# EAGLE design GERMO (EAGLE 9.4.2)
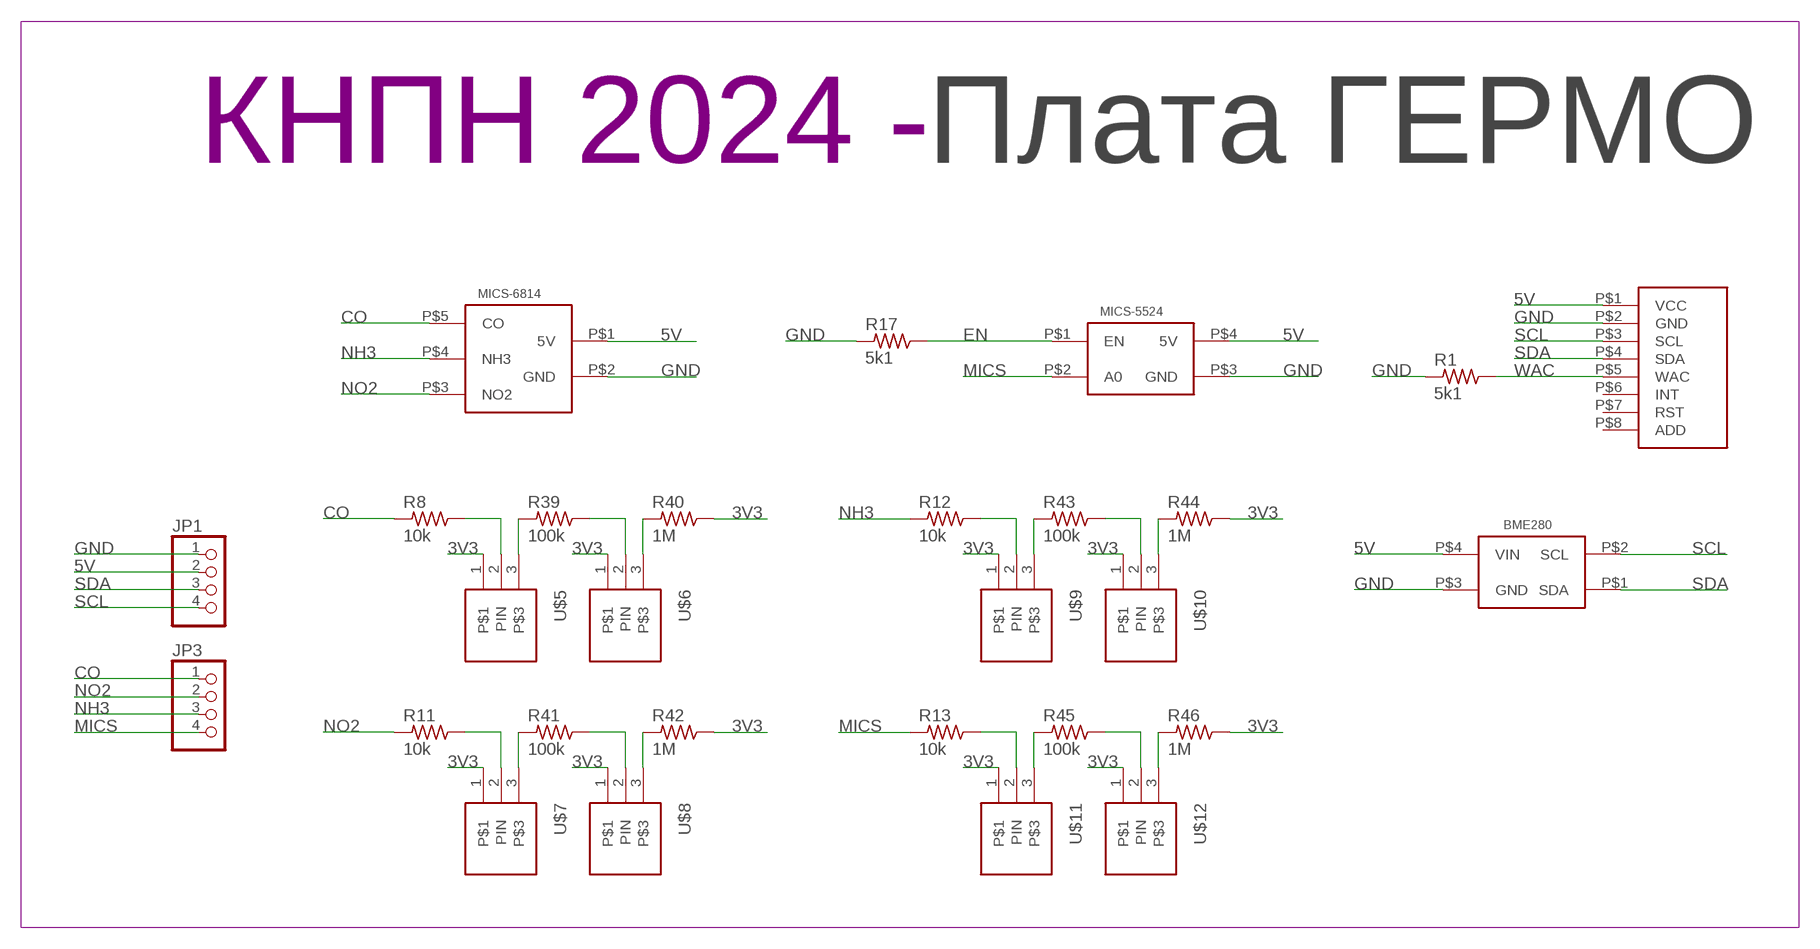
[diagram p0: schematic, sheet 1]

## Parts
BME280  BME280BME280-PINS-ONLY  [BME280-PINS-ONLY]
JP1  PINHD-1X4  [1X04]
JP3  PINHD-1X4  [1X04]
MICS-5524  MICS_5524  [MICS-5524]
MICS-6814  MICS-6814  [MICS-6814]
R1  5k1  R-US_R0603  [R0603]
R8  10k  R-US_R0603  [R0603]
R11  10k  R-US_R0603  [R0603]
R12  10k  R-US_R0603  [R0603]
R13  10k  R-US_R0603  [R0603]
R17  5k1  R-US_R0603  [R0603]
R39  100k  R-US_R0603  [R0603]
R40  1M  R-US_R0603  [R0603]
R41  100k  R-US_R0603  [R0603]
R42  1M  R-US_R0603  [R0603]
R43  100k  R-US_R0603  [R0603]
R44  1M  R-US_R0603  [R0603]
R45  100k  R-US_R0603  [R0603]
R46  1M  R-US_R0603  [R0603]
U$2  Плата ГЕРМО  LOGOPCB-""  [LOGO]
U$4  CCS811  [CSS811]
U$5  CONNECT_3  [CONNECT_3]
U$6  CONNECT_3  [CONNECT_3]
U$7  CONNECT_3  [CONNECT_3]
U$8  CONNECT_3  [CONNECT_3]
U$9  CONNECT_3  [CONNECT_3]
U$10  CONNECT_3  [CONNECT_3]
U$11  CONNECT_3  [CONNECT_3]
U$12  CONNECT_3  [CONNECT_3]

## Nets
3V3: R40.1 R42.1 R44.1 R46.1 U$5.1 U$6.1 U$7.1 U$8.1 U$9.1 U$10.1 U$11.1 U$12.1
5V: BME280.P$4(VIN) JP1.2 MICS-5524.P$4(5V) MICS-6814.P$1(5V) U$4.P$1(VCC)
CO: JP3.1 MICS-6814.P$5(CO) R8.2
EN: MICS-5524.P$1(EN) R17.1
GND: BME280.P$3(GND) JP1.1 MICS-5524.P$3(GND) MICS-6814.P$2(GND) R1.2 R17.2 U$4.P$2(GND)
MICS: JP3.4 MICS-5524.P$2(A0) R13.2
N$1: R39.2 U$5.3
N$2: R8.1 U$5.2(PIN)
N$3: R40.2 U$6.3
N$4: R39.1 U$6.2(PIN)
N$5: R41.2 U$7.3
N$6: R11.1 U$7.2(PIN)
N$7: R42.2 U$8.3
N$8: R41.1 U$8.2(PIN)
N$9: R43.2 U$9.3
N$10: R12.1 U$9.2(PIN)
N$11: R44.2 U$10.3
N$12: R43.1 U$10.2(PIN)
N$13: R45.2 U$11.3
N$14: R13.1 U$11.2(PIN)
N$15: R46.2 U$12.3
N$16: R45.1 U$12.2(PIN)
NH3: JP3.3 MICS-6814.P$4(NH3) R12.2
NO2: JP3.2 MICS-6814.P$3(NO2) R11.2
SCL: BME280.P$2(SCL) JP1.4 U$4.P$3(SCL)
SDA: BME280.P$1(SDA) JP1.3 U$4.P$4(SDA)
WAC: R1.1 U$4.P$5(WAC)
Unconnected: U$4.P$6(INT) U$4.P$7(RST) U$4.P$8(ADD)

## Library data of the parts
BME280 = UNKNOWN-2024:BME280
JP1 JP3 = pinhead:PINHD-1X4: PIN HEADER
MICS-5524 = UNKNOWN-2024:MICS_5524
MICS-6814 = CanCubeSat:MICS-6814
R1 R8 R11-R13 R17 R39-R46 = rcl:R-US_: RESISTOR, American symbol; SPICEPREFIX: R
U$2 = UNKNOWN-2024:LOGO
U$4 = UNKNOWN-2024:CCS811
U$5-U$12 = UNKNOWN-2024:CONNECT_3

## Board
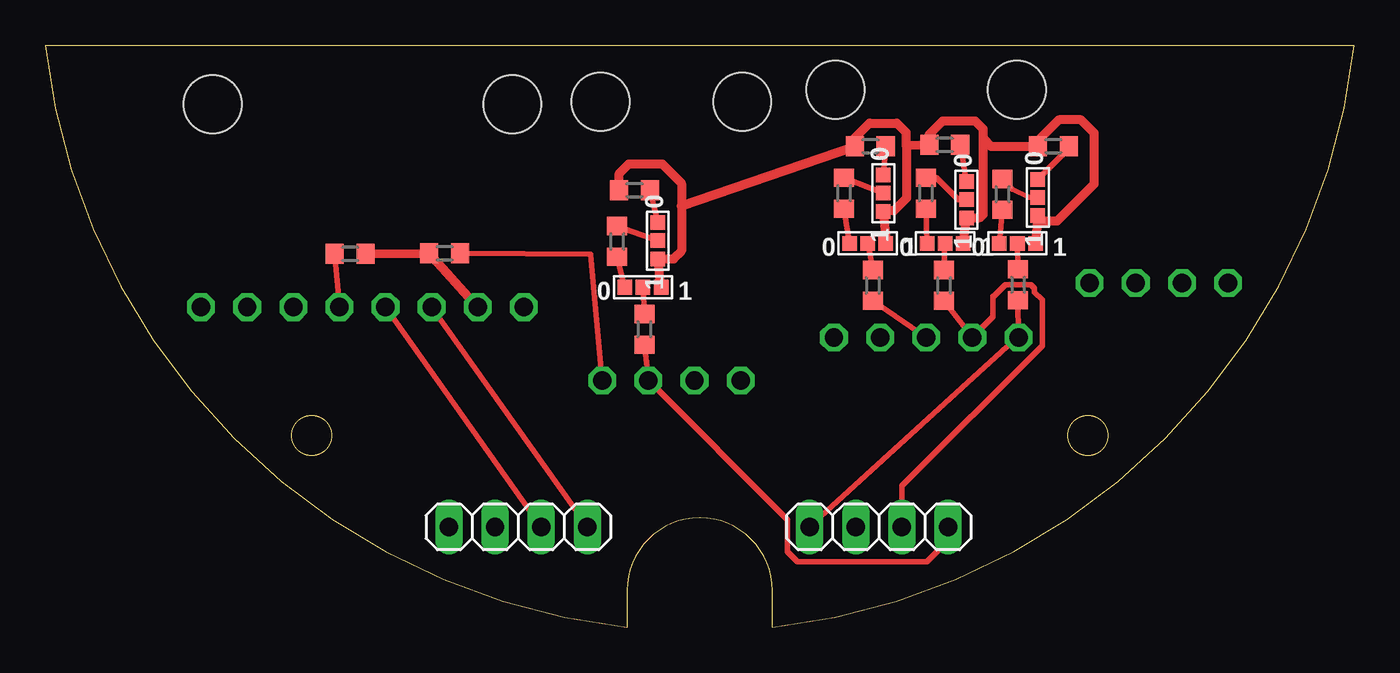
[diagram p1: board, top side]
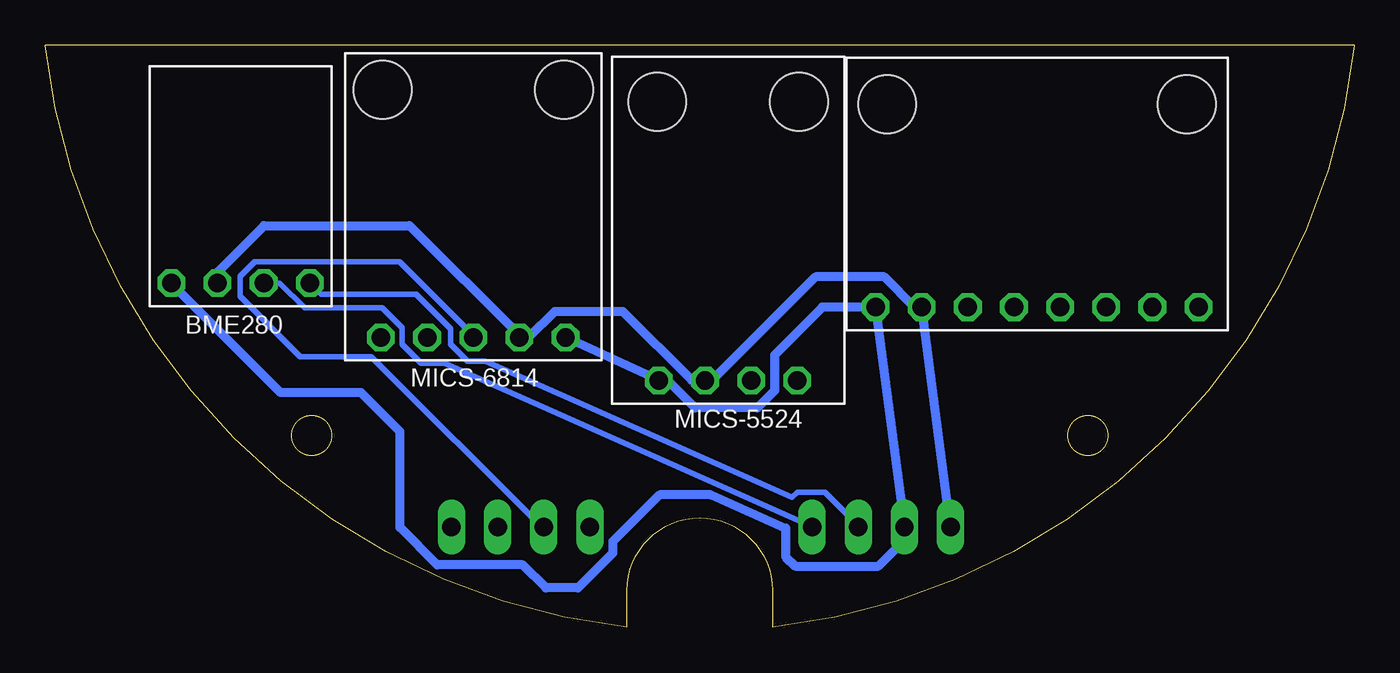
[diagram p2: board, bottom side, seen from below]

Size 72.06 x 32.03 mm. Coordinates in mm from the lower left corner, seen from the top.
Outline: 32.03,2.03 32.03,0 arc-77 0,32.03 72.06,32.03 arc-77 40.03,0 40.03,2.03 arc180 32.03,2.03
Outline: circle at 14.66,10.56 radius 1.1
Outline: circle at 57.4,10.56 radius 1.1
Copper layers (1*16): Top 0.035mm / dielectric 1.5mm / Bottom 0.035mm
Design rules "default *": minimum track width 0.3mm, minimum drill 0.35mm, track to track 0.2mm, track to pad 0.2mm, pad to pad 0.2mm, via to via 0.2mm, smd to smd 0.2mm, copper to edge 0.35mm, drill to drill 0.2mm, minimum pad ring 10mil, minimum via ring 8mil, stop-mask expansion 4mil, vias tented up to drill 0mil, thermal gap 10mil

### Footprints (pad centres in the part's own frame; a part is rotated, then mirrored left to right if it is on the bottom)
BME280-PINS-ONLY = drill 1.016 octagon: P$1 -3.81,5.33; P$2 -1.27,5.33; P$3 1.27,5.33; P$4 3.81,5.33
1X04 = drill 1.016 long: 1 -3.81,0; 2 -1.27,0; 3 1.27,0; 4 3.81,0
MICS-5524 = drill 1.016 octagon: P$1 -3.81,8.28; P$2 -1.27,8.28; P$3 1.27,8.28; P$4 3.81,8.28 | hole 3.2: -3.9,-7.05; 3.9,-7.05
MICS-6814 = drill 1.016 octagon: P$1 -5.08,7.18; P$2 -2.54,7.18; P$3 0,7.18; P$4 2.54,7.18; P$5 5.08,7.18 | hole 3.2: -5,-6.45; 5,-6.45
R0603 = smd 1 x 1.1: 1 -0.85,0; 2 0.85,0
CSS811 = drill 1.016 octagon: P$1 6.23,-8.89; P$2 6.23,-6.35; P$3 6.23,-3.81; P$4 6.23,-1.27; P$5 6.23,1.27; P$6 6.23,3.81; P$7 6.23,6.35; P$8 6.23,8.89 | hole 3.2: -4.95,-8.25; -4.95,8.25
CONNECT_3 = smd 0.8 x 0.8: 1 1,0; 2 0,0; 3 -1,0

### Placement (x,y rotation side)
BME280  61.31,24.28 180 bottom
JP1  26.03,5.53 0 top
JP3  45.89,5.53 0 top
MICS-5524  34.47,21.87 180 bottom
MICS-6814  48.5,23.14 180 bottom
R1  16.78,20.56 0 top
R8  53.56,18.86 270 top
R11  45.56,18.82 270 top
R12  49.48,18.82 270 top
R13  32.98,16.4 270 top
R17  21.98,20.58 180 top
R39  52.7,23.83 270 top
R40  55.5,26.48 0 top
R41  43.98,23.89 270 top
R42  45.42,26.48 0 top
R43  48.48,23.89 270 top
R44  49.52,26.56 0 top
R45  31.48,21.24 270 top
R46  32.44,24.06 0 top
U$2  28.73,41.06 0 top  (outside the outline)
U$4  17.46,23.85 270 bottom
U$5  53.52,21.14 0 top
U$6  54.64,23.66 270 top
U$7  45.28,21.14 0 top
U$8  46.14,23.9 270 top
U$9  49.54,21.14 0 top
U$10  50.72,23.54 270 top
U$11  32.9,18.72 0 top
U$12  33.72,21.28 270 top

### Tracks (layer width: path | path; a pad name or v marks a point on that pad's centre or on a via)
3V3
  Top 0.5: U$11.1 U$12.1 34.59,20.28 35.02,20.71 35.02,23.2 | 35.02,23.2 35.02,24.45 33.96,25.51 32.12,25.51 31.59,24.98 R46.1 | 35.02,23.2 R42.1 44.57,26.94 45.38,27.75 46.88,27.75 47.39,27.24 47.39,26.53 47.42,26.53 | 47.42,26.53 47.42,23.63 46.73,22.94 46.18,22.94 U$8.1 U$7.1 | 47.42,26.53 47.52,26.54 R44.1 48.67,27.13 49.42,27.88 51.18,27.88 51.64,27.42 51.64,26.91 | 51.64,26.91 52.07,26.48 R40.1 54.65,26.79 55.79,27.93 57.02,27.93 57.75,27.2 57.75,24.4 55.71,22.36 54.94,22.36 U$6.1 U$5.1 | U$9.1 U$10.1 50.73,22.55 51.46,22.55 51.64,22.73 51.64,26.91
5V
  Bottom 0.5: MICS-6814.P$1 MICS-5524.P$4 37.81,13.59 36.3,12.08 32.86,12.08 31.91,13.03 31.91,14.98 29.28,17.62 U$4.P$1 JP1.2 24.76,4.8 26.2,3.36 30.77,3.36 31.3,3.89 31.3,5.46 35.42,7.29 38.24,7.29 40.82,4.71 40.82,4.09 42.74,2.17 44.5,2.17 45.77,3.44 50.48,3.44 52.53,5.5 52.53,10.77 54.69,12.92 59.09,12.92 BME280.P$4
CO
  Top 0.3: R8.2 53.58,16.02 | 53.58,16.02 MICS-6814.P$5 | JP3.1 53.58,16.02
EN
  Top 0.3: R17.1 30.03,20.53 MICS-5524.P$1
GND
  Top 0.5: R1.2 R17.2 U$4.P$2
  Bottom 0.5: JP1.1 U$4.P$2 24.2,17.62 25.87,19.28 29.65,19.28 35.34,13.59 MICS-5524.P$3 36.46,13.59 40.26,17.38 44.02,17.38 45.44,15.96 MICS-6814.P$2 45.96,16.07 52.01,22.11 60.02,22.11 62.58,19.56 BME280.P$3
MICS
  Top 0.3: R13.2 MICS-5524.P$2 40.86,5.92 40.86,4.17 41.42,3.61 48.55,3.61 49.7,4.76 JP3.4
N$1
  Top 0.3: U$5.3 R39.2
N$2
  Top 0.3: R8.1 U$5.2
N$3
  Top 0.3: U$6.3 56.4,26.42 R40.2
N$4
  Top 0.3: U$6.2 54.14,23.66 53.25,24.12 R39.1
N$5
  Top 0.3: U$7.3 R41.2
N$6
  Top 0.3: R11.1 U$7.2
N$7
  Top 0.3: R42.2 U$8.3
N$8
  Top 0.3: R41.1 U$8.2
N$9
  Top 0.3: U$9.3 R43.2
N$10
  Top 0.3: U$9.2 R12.1
N$11
  Top 0.3: U$10.3 R44.2
N$12
  Top 0.3: R43.1 49.06,24.74 50.26,23.54 U$10.2
N$13
  Top 0.3: R45.2 U$11.3
N$14
  Top 0.3: U$11.2 R13.1
N$15
  Top 0.3: R46.2 U$12.3
N$16
  Top 0.3: U$12.2 R45.1
NH3
  Top 0.3: R12.2 MICS-6814.P$4 52.18,17.1 52.18,18.22 52.22,18.22 52.86,18.86 54.25,18.86 54.46,18.65 54.46,18.45 54.88,18.03 54.88,15.51 47.16,7.78 JP3.3
NO2
  Top 0.3: R11.2 48.49,15.97 MICS-6814.P$3
  Bottom 0.3: JP3.2 44.67,5.58 44.8,5.58 54.11,14.89 58.02,14.89 61.34,18.22 61.34,19.33 60.54,20.13 52.57,20.13 48.5,16.06 MICS-6814.P$3
SCL
  Top 0.3: JP1.4 U$4.P$3
  Bottom 0.3: JP1.4 29.88,5.57 50.07,14.54 51.36,14.54 52.4,15.59 52.4,16.48 53.51,17.58 57.79,17.58 59.15,18.95 BME280.P$2
SDA
  Top 0.3: U$4.P$4 JP1.3
  Bottom 0.3: BME280.P$1 56.89,18.34 51.64,18.34 49.73,16.43 49.73,15.58 48.81,14.65 47.83,14.65 30.94,7.15 30.66,7.42 29.14,7.42 27.3,5.59 JP1.3
WAC
  Top 0.3: R1.1 U$4.P$5